# Altium project DONUts.PrjPCB
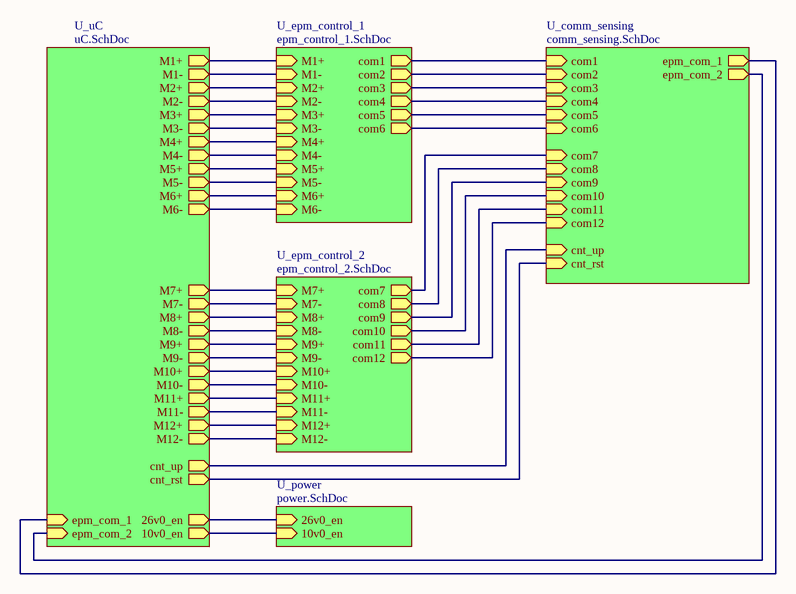
[diagram p0: DONUt_toplevel.SchDoc]
6 sheets, 266 parts. Net scope: hierarchical (ports join the sheet entries above them; power ports are global).
Board file: DONUt_v0.0.PcbDoc
Sheets:
  DONUt_toplevel.SchDoc
    U_power = power.SchDoc
    U_comm_sensing = comm_sensing.SchDoc
    U_uC = uC.SchDoc
    U_epm_control_1 = epm_control_1.SchDoc
    U_epm_control_2 = epm_control_2.SchDoc

## Sheet DONUt_toplevel.SchDoc
size A

### Sub-sheets
U_comm_sensing = comm_sensing.SchDoc: com1 (in), com2 (in), com3 (in), com4 (in), com5 (in), com6 (in), com7 (in), com8 (in), com9 (in), com10 (in), com11 (in), com12 (in), cnt_rst (in), cnt_up (in), epm_com_1 (out), epm_com_2 (out)
U_epm_control_1 = epm_control_1.SchDoc: M1+ (in), M1- (in), M2+ (in), M2- (in), com1 (out), com2 (out), com3 (out), com4 (out), com5 (out), com6 (out), M3+ (in), M3- (in), M4+ (in), M4- (in), M5+ (in), M5- (in), M6+ (in), M6- (in)
U_epm_control_2 = epm_control_2.SchDoc: com7 (out), com8 (out), com9 (out), com10 (out), com11 (out), com12 (out), M7+ (in), M7- (in), M8+ (in), M8- (in), M9+ (in), M9- (in), M10+ (in), M10- (in), M11+ (in), M11- (in), M12+ (in), M12- (in)
U_power = power.SchDoc: 26v0_en (in), 10v0_en (in)
U_uC = uC.SchDoc: M4- (out), M4+ (out), M3- (out), M3+ (out), M8- (out), M9+ (out), M9- (out), M10+ (out), M6- (out), M7+ (out), M7- (out), M8+ (out), M2- (out), M2+ (out), M1- (out), M1+ (out), M5- (out), M6+ (out), M5+ (out), M10- (out), M11+ (out), M11- (out), M12+ (out), M12- (out), 10v0_en (out), 26v0_en (out), cnt_up (out), cnt_rst (out), epm_com_2 (in), epm_com_1 (in)

### Nets
M1+: sheet U_uC/M1+, sheet U_epm_control_1/M1+
M1-: sheet U_uC/M1-, sheet U_epm_control_1/M1-
M2+: sheet U_uC/M2+, sheet U_epm_control_1/M2+
M2-: sheet U_uC/M2-, sheet U_epm_control_1/M2-
M3+: sheet U_uC/M3+, sheet U_epm_control_1/M3+
M3-: sheet U_uC/M3-, sheet U_epm_control_1/M3-
M4+: sheet U_uC/M4+, sheet U_epm_control_1/M4+
M4-: sheet U_uC/M4-, sheet U_epm_control_1/M4-
M5+: sheet U_uC/M5+, sheet U_epm_control_1/M5+
M5-: sheet U_uC/M5-, sheet U_epm_control_1/M5-
M6+: sheet U_uC/M6+, sheet U_epm_control_1/M6+
M6-: sheet U_uC/M6-, sheet U_epm_control_1/M6-
M7+: sheet U_uC/M7+, sheet U_epm_control_2/M7+
M7-: sheet U_uC/M7-, sheet U_epm_control_2/M7-
M8+: sheet U_uC/M8+, sheet U_epm_control_2/M8+
M8-: sheet U_uC/M8-, sheet U_epm_control_2/M8-
M9+: sheet U_uC/M9+, sheet U_epm_control_2/M9+
M9-: sheet U_uC/M9-, sheet U_epm_control_2/M9-
M10+: sheet U_uC/M10+, sheet U_epm_control_2/M10+
M10-: sheet U_uC/M10-, sheet U_epm_control_2/M10-
M11+: sheet U_uC/M11+, sheet U_epm_control_2/M11+
M11-: sheet U_uC/M11-, sheet U_epm_control_2/M11-
M12+: sheet U_uC/M12+, sheet U_epm_control_2/M12+
M12-: sheet U_uC/M12-, sheet U_epm_control_2/M12-
NetR173_1: sheet U_comm_sensing/com1, sheet U_epm_control_1/com1
NetR174_1: sheet U_comm_sensing/com2, sheet U_epm_control_1/com2
NetR175_1: sheet U_comm_sensing/com3, sheet U_epm_control_1/com3
NetR176_1: sheet U_comm_sensing/com4, sheet U_epm_control_1/com4
NetR177_1: sheet U_comm_sensing/com5, sheet U_epm_control_1/com5
NetR178_1: sheet U_comm_sensing/com6, sheet U_epm_control_1/com6
NetR179_1: sheet U_comm_sensing/com7, sheet U_epm_control_2/com7
NetR180_1: sheet U_comm_sensing/com8, sheet U_epm_control_2/com8
NetR181_1: sheet U_comm_sensing/com9, sheet U_epm_control_2/com9
NetR182_1: sheet U_comm_sensing/com10, sheet U_epm_control_2/com10
NetR183_1: sheet U_comm_sensing/com11, sheet U_epm_control_2/com11
NetR184_1: sheet U_comm_sensing/com12, sheet U_epm_control_2/com12
NetU1_25: sheet U_power/26v0_en, sheet U_uC/26v0_en
NetU1_26: sheet U_power/10v0_en, sheet U_uC/10v0_en
NetU2_19: sheet U_comm_sensing/epm_com_2, sheet U_uC/epm_com_2
NetU2_22: sheet U_comm_sensing/epm_com_1, sheet U_uC/epm_com_1
NetU2_23: sheet U_comm_sensing/cnt_rst, sheet U_uC/cnt_rst
NetU2_24: sheet U_comm_sensing/cnt_up, sheet U_uC/cnt_up

## Sheet power.SchDoc
size A
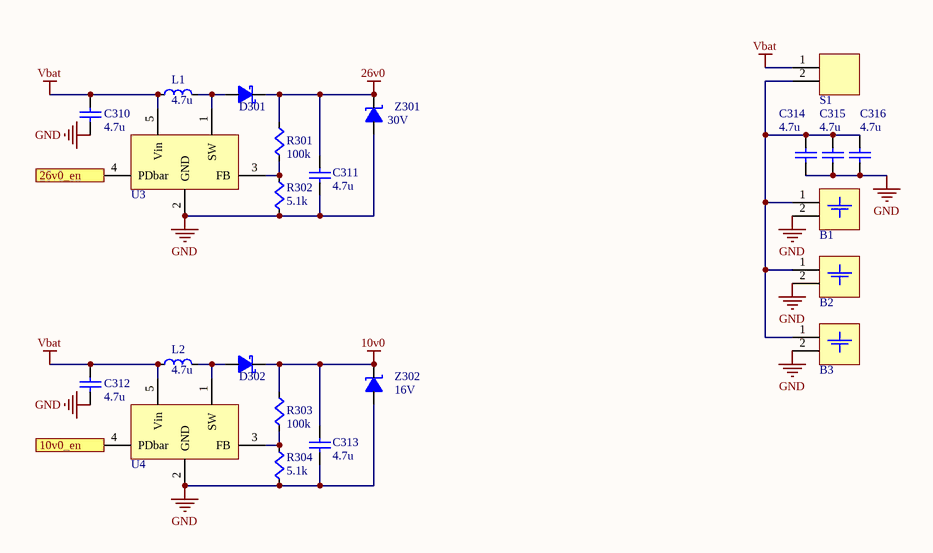
[diagram p1: power.SchDoc]

### Parts
B1  Batt  [batt_pads]  (value not drawn)
B2  Batt  [batt_pads]  (value not drawn)
B3  Batt  [batt_pads]  (value not drawn)
C310  value 4.7u  [SMD0603_cap]  (hidden comment: Cap)
C311  value 4.7u  [SMD0603_cap]  (hidden comment: Cap)
C312  value 4.7u  [SMD0603_cap]  (hidden comment: Cap)
C313  value 4.7u  [SMD0603_cap]  (hidden comment: Cap)
C314  value 4.7u  [SMD0603_cap]  (hidden comment: Cap)
C315  value 4.7u  [SMD0603_cap]  (hidden comment: Cap)
C316  value 4.7u  [SMD0603_cap]  (hidden comment: Cap)
D301  Shottky  [sod-323f]  (value not drawn)
D302  Shottky  [sod-323f]  (value not drawn)
L1  value 4.7u  [smd_0806]  (hidden comment: Inductor)
L2  value 4.7u  [smd_0806]  (hidden comment: Inductor)
R301  value 100k  [SMD0603]  (hidden comment: Res)
R302  value 5.1k  [SMD0603]  (hidden comment: Res)
R303  value 100k  [SMD0603]  (hidden comment: Res)
R304  value 5.1k  [SMD0603]  (hidden comment: Res)
S1  Header_smd-2x1  [header_smd-2x1]  (value not drawn)
U3  AP3012  [SOT23-5Lead]  (value not drawn)
U4  AP3012  [SOT23-5Lead]  (value not drawn)
Z301  value 30V  [SOD-323F]  (hidden comment: Zener)
Z302  value 16V  [SOD-323F]  (hidden comment: Zener)

### Ports
10v0_en (in), 26v0_en (in)

### Nets
10v0: C313.2 D302.K R303.2 Z302.K
26v0: C311.2 D301.K R301.2 Z301.K
GND: B1.2 B2.2 B3.2 C310.1 C311.1 C312.1 C313.1 C314.1 C315.1 C316.1 R302.1 R304.1 U3.2(GND) U4.2(GND) Z301.A Z302.A
Vbat: C310.2 C312.2 L1.1(Source) L2.1(Source) S1.1 U3.5(Vin) U4.5(Vin)
NetB1_1: B1.1 B2.1 B3.1 C314.2 C315.2 C316.2 S1.2
NetD301_A: D301.A L1.2(Source) U3.1(SW)
NetD302_A: D302.A L2.2(Source) U4.1(SW)
NetR301_1: R301.1 R302.2 U3.3(FB)
NetR303_1: R303.1 R304.2 U4.3(FB)
NetU1_25: U3.4(PDbar) ; port 26v0_en
NetU1_26: U4.4(PDbar) ; port 10v0_en

### Library data of the parts
C310-C316 = Capacitor Ceramic: Ceramic Chip Capacitor
L1 L2 = Inductor: Code_IEC: 1005; Published: 8-Jun-2000; LatestRevisionDate: 29-May-2009; LatestRevisionNote: IPC-7351 Footprint Added.; PackageReference: 0402-A; Publisher: Altium Limited; PackageDescription: Chip Inductor; Code_JEITA: 0402
R301-R304 = Resistor

## Sheet comm_sensing.SchDoc
size A
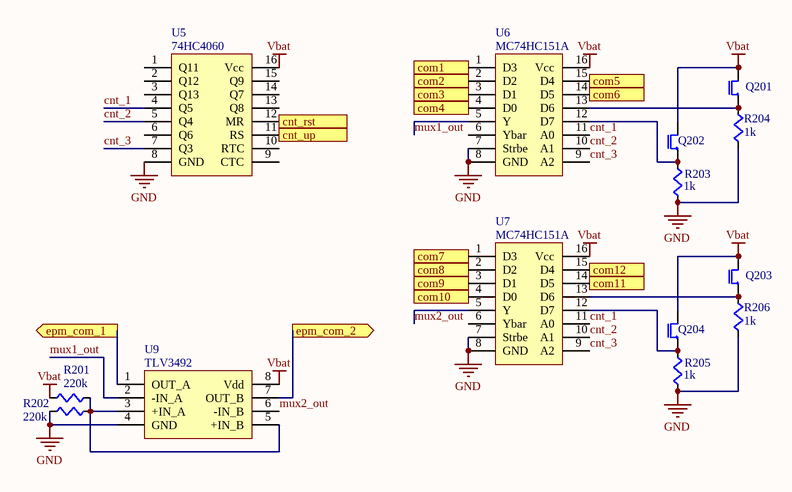
[diagram p2: comm_sensing.SchDoc]

### Parts
Q201  PHOTOTRANS  [smd_phototrans]  (value not drawn)
Q202  PHOTOTRANS  [smd_phototrans]  (value not drawn)
Q203  PHOTOTRANS  [smd_phototrans]  (value not drawn)
Q204  PHOTOTRANS  [smd_phototrans]  (value not drawn)
R201  value 220k  [SMD0603]  (hidden comment: Res)
R202  value 220k  [SMD0603]  (hidden comment: Res)
R203  value 1k  [SMD0603]  (hidden comment: Res)
R204  value 1k  [SMD0603]  (hidden comment: Res)
R205  value 1k  [SMD0603]  (hidden comment: Res)
R206  value 1k  [SMD0603]  (hidden comment: Res)
U5  74HC4060  [dhvqfn-16]
U6  MC74HC151A  [soic-16]
U7  MC74HC151A  [soic-16]
U9  TLV3492  [sot23-8]

### Ports
cnt_rst (in), cnt_up (in), com1 (in), com2 (in), com3 (in), com4 (in), com5 (in), com6 (in), com7 (in), com8 (in), com9 (in), com10 (in), com11 (in), com12 (in), epm_com_1 (out), epm_com_2 (out)

### Nets
GND: R202.2 R203.2 R204.2 R205.2 R206.2 U5.8(GND) U6.7(Strbe) U6.8(GND) U7.7(Strbe) U7.8(GND) U9.4(GND)
Vbat: Q201.1(Collector) Q202.1(Collector) Q203.1(Collector) Q204.1(Collector) R201.2 U5.16(Vcc) U6.16(Vcc) U7.16(Vcc) U9.8(Vdd)
cnt_1: U5.4(Q5) U6.11(A0) U7.11(A0)
cnt_2: U5.5(Q4) U6.10(A1) U7.10(A1)
cnt_3: U5.7(Q3) U6.9(A2) U7.9(A2)
mux1_out: U6.5(Y) U9.2(-IN_A)
mux2_out: U7.5(Y) U9.6(-IN_B)
NetQ201_2: Q201.2(Emitter) R204.1 U6.13(D6)
NetQ202_2: Q202.2(Emitter) R203.1 U6.12(D7)
NetQ203_2: Q203.2(Emitter) R206.1 U7.13(D6)
NetQ204_2: Q204.2(Emitter) R205.1 U7.12(D7)
NetR173_1: U6.1(D3) ; port com1
NetR174_1: U6.2(D2) ; port com2
NetR175_1: U6.3(D1) ; port com3
NetR176_1: U6.4(D0) ; port com4
NetR177_1: U6.15(D4) ; port com5
NetR178_1: U6.14(D5) ; port com6
NetR179_1: U7.1(D3) ; port com7
NetR180_1: U7.2(D2) ; port com8
NetR181_1: U7.3(D1) ; port com9
NetR182_1: U7.4(D0) ; port com10
NetR183_1: U7.14(D5) ; port com11
NetR184_1: U7.15(D4) ; port com12
NetR201_1: R201.1 R202.1 U9.3(+IN_A) U9.5(+IN_B)
NetU2_19: U9.7(OUT_B) ; port epm_com_2
NetU2_22: U9.1(OUT_A) ; port epm_com_1
NetU2_23: U5.12(MR) ; port cnt_rst
NetU2_24: U5.11(RS) ; port cnt_up

Not connected (* = marked no-connect by the designer): U5 1(Q11) 2(Q12) 3(Q13) 6(Q6) 9(CTC) 10(RTC) 13(Q8) 14(Q7) 15(Q9); U6 6(Ybar); U7 6(Ybar)

### Library data of the parts
R201-R206 = Resistor

## Sheet uC.SchDoc
size A
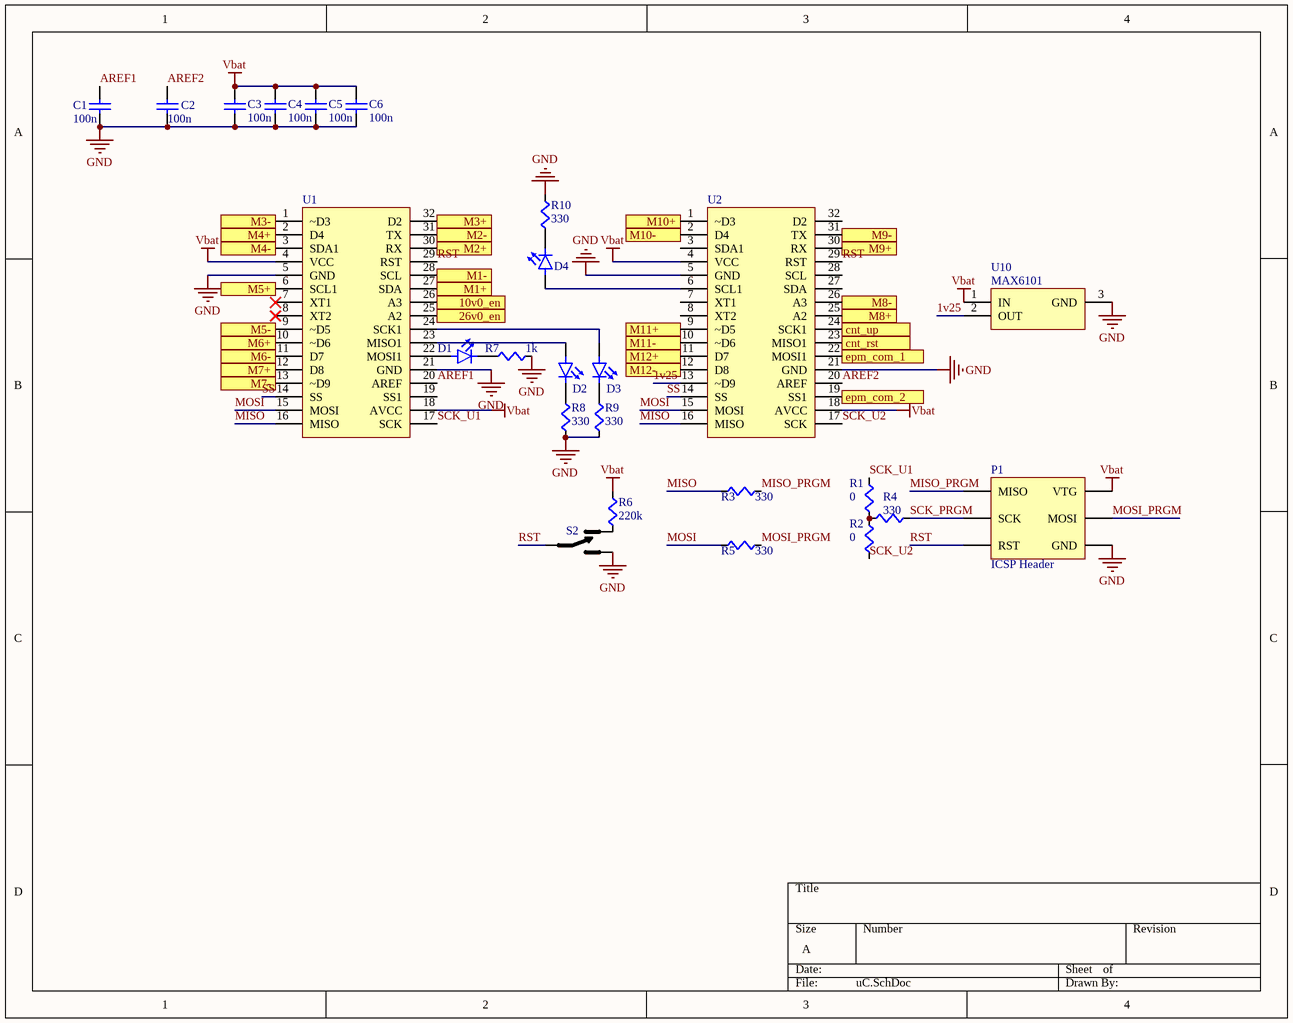
[diagram p3: uC.SchDoc]

### Parts
C1  value 100n  [SMD0603_cap]  (hidden comment: Cap)
C2  value 100n  [SMD0603_cap]  (hidden comment: Cap)
C3  value 100n  [SMD0603_cap]  (hidden comment: Cap)
C4  value 100n  [SMD0603_cap]  (hidden comment: Cap)
C5  value 100n  [SMD0603_cap]  (hidden comment: Cap)
C6  value 100n  [SMD0603_cap]  (hidden comment: Cap)
D1  LED  [SMD0603 POLARIZED]  (value not drawn)
D2  IR_LED  [smd_phototrans]  (value not drawn)
D3  IR_LED  [smd_phototrans]  (value not drawn)
D4  IR_LED  [smd_phototrans]  (value not drawn)
P1  ICSP Header  [icsp_pads]
R1  value 0  [SMD0603]  (hidden comment: Res)
R2  value 0  [SMD0603]  (hidden comment: Res)
R3  value 330  [SMD0603]  (hidden comment: Res)
R4  value 330  [SMD0603]  (hidden comment: Res)
R5  value 330  [SMD0603]  (hidden comment: Res)
R6  value 220k  [SMD0603]  (hidden comment: Res)
R7  value 1k  [SMD0603]  (hidden comment: Res)
R8  value 330  [SMD0603]  (hidden comment: Res)
R9  value 330  [SMD0603]  (hidden comment: Res)
R10  value 330  [SMD0603]  (hidden comment: Res)
S2  Switch_SPDT  [Switch_SPDT]  (value not drawn)
U1  ATMega328P_vqfn  [vqfn-32]  (value not drawn)
U2  ATMega328P_vqfn  [vqfn-32]  (value not drawn)
U10  MAX6101  [sot23]

### Ports
10v0_en (out), 26v0_en (out), cnt_rst (out), cnt_up (out), epm_com_1 (in), epm_com_2 (in), M1+ (out), M1- (out), M2+ (out), M2- (out), M3+ (out), M3- (out), M4+ (out), M4- (out), M5+ (out), M5- (out), M6+ (out), M6- (out), M7+ (out), M7- (out), M8+ (out), M8- (out), M9+ (out), M9- (out), M10+ (out), M10- (out), M11+ (out), M11- (out), M12+ (out), M12- (out)

### Nets
GND: C1.1 C2.1 C3.1 C4.1 C5.1 C6.1 P1.6(GND) R7.2 R8.1 R9.1 R10.1 S2.1 U1.5(GND) U1.21(GND) U2.5(GND) U2.21(GND) U10.3(GND)
Vbat: C3.2 C4.2 C5.2 C6.2 P1.2(VTG) R6.1 U1.4(VCC) U1.18(AVCC) U2.4(VCC) U2.18(AVCC) U10.1(IN)
1v25: U2.13(~D9) U10.2(OUT)
AREF1: C1.2 U1.20(AREF)
AREF2: C2.2 U2.20(AREF)
M1+: U1.27(SDA) ; port M1+
M1-: U1.28(SCL) ; port M1-
M2+: U1.30(RX) ; port M2+
M2-: U1.31(TX) ; port M2-
M3+: U1.32(D2) ; port M3+
M3-: U1.1(~D3) ; port M3-
M4+: U1.2(D4) ; port M4+
M4-: U1.3(SDA1) ; port M4-
M5+: U1.6(SCL1) ; port M5+
M5-: U1.9(~D5) ; port M5-
M6+: U1.10(~D6) ; port M6+
M6-: U1.11(D7) ; port M6-
M7+: U1.12(D8) ; port M7+
M7-: U1.13(~D9) ; port M7-
M8+: U2.25(A2) ; port M8+
M8-: U2.26(A3) ; port M8-
M9+: U2.30(RX) ; port M9+
M9-: U2.31(TX) ; port M9-
M10+: U2.1(~D3) ; port M10+
M10-: U2.2(D4) ; port M10-
M11+: U2.9(~D5) ; port M11+
M11-: U2.10(~D6) ; port M11-
M12+: U2.11(D7) ; port M12+
M12-: U2.12(D8) ; port M12-
MISO: R3.2 U1.16(MISO) U2.16(MISO)
MISO_PRGM: P1.1(MISO) R3.1
MOSI: R5.2 U1.15(MOSI) U2.15(MOSI)
MOSI_PRGM: P1.4(MOSI) R5.1
RST: P1.5(RST) S2.2 U1.29(RST) U2.29(RST)
SCK_PRGM: P1.3(SCK) R4.1
SCK_U1: R1.2 U1.17(SCK)
SCK_U2: R2.1 U2.17(SCK)
SS: U1.14(SS) U2.14(SS)
NetD1_1: D1.1(Anode_(+)) U1.22(MOSI1)
NetD1_2: D1.2(Cathode_(-)) R7.1
NetD2_1: D2.1(Anode_(+)) U1.23(MISO1)
NetD2_2: D2.2(Cathode_(-)) R8.2
NetD3_1: D3.1(Anode_(+)) U1.24(SCK1)
NetD3_2: D3.2(Cathode_(-)) R9.2
NetD4_1: D4.1(Anode_(+)) U2.6(SCL1)
NetD4_2: D4.2(Cathode_(-)) R10.2
NetR1_1: R1.1 R2.2 R4.2
NetR6_2: R6.2 S2.3
NetU1_25: U1.25(A2) ; port 26v0_en
NetU1_26: U1.26(A3) ; port 10v0_en
NetU2_19: U2.19(SS1) ; port epm_com_2
NetU2_22: U2.22(MOSI1) ; port epm_com_1
NetU2_23: U2.23(MISO1) ; port cnt_rst
NetU2_24: U2.24(SCK1) ; port cnt_up

Not connected (* = marked no-connect by the designer): U1 7(XT1)* 8(XT2)* 19(SS1); U2 3(SDA1) 7(XT1) 8(XT2) 27(SDA) 28(SCL) 32(D2)

### Library data of the parts
C1-C6 = Capacitor Ceramic: Ceramic Chip Capacitor
R1-R10 = Resistor

## Sheet epm_control_1.SchDoc
size A
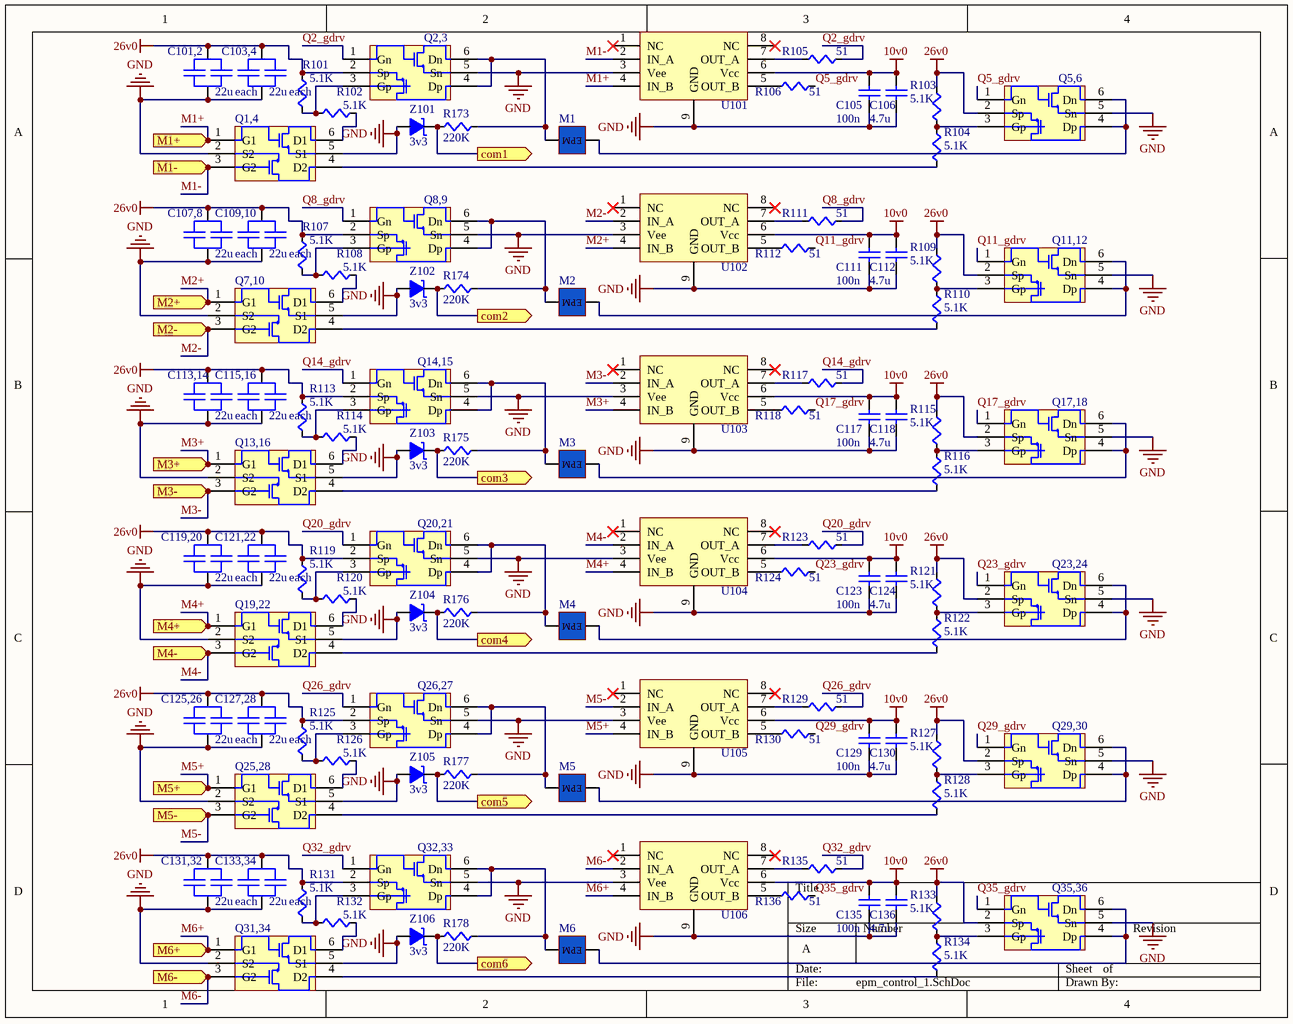
[diagram p4: epm_control_1.SchDoc]

### Parts
C101,2  value 22u  [dicap_smd_1206]  (hidden comment: Dicap)
C103,4  value 22u  [dicap_smd_1206]  (hidden comment: Dicap)
C105  value 100n  [SMD0603_cap]  (hidden comment: Cap)
C106  value 4.7u  [SMD0603_cap]  (hidden comment: Cap)
C107,8  value 22u  [dicap_smd_1206]  (hidden comment: Dicap)
C109,10  value 22u  [dicap_smd_1206]  (hidden comment: Dicap)
C111  value 100n  [SMD0603_cap]  (hidden comment: Cap)
C112  value 4.7u  [SMD0603_cap]  (hidden comment: Cap)
C113,14  value 22u  [dicap_smd_1206]  (hidden comment: Dicap)
C115,16  value 22u  [dicap_smd_1206]  (hidden comment: Dicap)
C117  value 100n  [SMD0603_cap]  (hidden comment: Cap)
C118  value 4.7u  [SMD0603_cap]  (hidden comment: Cap)
C119,20  value 22u  [dicap_smd_1206]  (hidden comment: Dicap)
C121,22  value 22u  [dicap_smd_1206]  (hidden comment: Dicap)
C123  value 100n  [SMD0603_cap]  (hidden comment: Cap)
C124  value 4.7u  [SMD0603_cap]  (hidden comment: Cap)
C125,26  value 22u  [dicap_smd_1206]  (hidden comment: Dicap)
C127,28  value 22u  [dicap_smd_1206]  (hidden comment: Dicap)
C129  value 100n  [SMD0603_cap]  (hidden comment: Cap)
C130  value 4.7u  [SMD0603_cap]  (hidden comment: Cap)
C131,32  value 22u  [dicap_smd_1206]  (hidden comment: Dicap)
C133,34  value 22u  [dicap_smd_1206]  (hidden comment: Dicap)
C135  value 100n  [SMD0603_cap]  (hidden comment: Cap)
C136  value 4.7u  [SMD0603_cap]  (hidden comment: Cap)
M1  EPM  [40awg_epm]  (value not drawn)
M2  EPM  [40awg_epm]  (value not drawn)
M3  EPM  [40awg_epm]  (value not drawn)
M4  EPM  [40awg_epm]  (value not drawn)
M5  EPM  [40awg_epm]  (value not drawn)
M6  EPM  [40awg_epm]  (value not drawn)
Q1,4  SI3292  [sot23-6l]  (value not drawn)
Q2,3  DMG6602  [sot23-6l]  (value not drawn)
Q5,6  DMG6602  [sot23-6l]  (value not drawn)
Q7,10  SI3292  [sot23-6l]  (value not drawn)
Q8,9  DMG6602  [sot23-6l]  (value not drawn)
Q11,12  DMG6602  [sot23-6l]  (value not drawn)
Q13,16  SI3292  [sot23-6l]  (value not drawn)
Q14,15  DMG6602  [sot23-6l]  (value not drawn)
Q17,18  DMG6602  [sot23-6l]  (value not drawn)
Q19,22  SI3292  [sot23-6l]  (value not drawn)
Q20,21  DMG6602  [sot23-6l]  (value not drawn)
Q23,24  DMG6602  [sot23-6l]  (value not drawn)
Q25,28  SI3292  [sot23-6l]  (value not drawn)
Q26,27  DMG6602  [sot23-6l]  (value not drawn)
Q29,30  DMG6602  [sot23-6l]  (value not drawn)
Q31,34  SI3292  [sot23-6l]  (value not drawn)
Q32,33  DMG6602  [sot23-6l]  (value not drawn)
Q35,36  DMG6602  [sot23-6l]  (value not drawn)
R101  value 5.1K  [SMD0603]  (hidden comment: Res)
R102  value 5.1K  [SMD0603]  (hidden comment: Res)
R103  value 5.1K  [SMD0603]  (hidden comment: Res)
R104  value 5.1K  [SMD0603]  (hidden comment: Res)
R105  value 51  [SMD0603]  (hidden comment: Res)
R106  value 51  [SMD0603]  (hidden comment: Res)
R107  value 5.1K  [SMD0603]  (hidden comment: Res)
R108  value 5.1K  [SMD0603]  (hidden comment: Res)
R109  value 5.1K  [SMD0603]  (hidden comment: Res)
R110  value 5.1K  [SMD0603]  (hidden comment: Res)
R111  value 51  [SMD0603]  (hidden comment: Res)
R112  value 51  [SMD0603]  (hidden comment: Res)
R113  value 5.1K  [SMD0603]  (hidden comment: Res)
R114  value 5.1K  [SMD0603]  (hidden comment: Res)
R115  value 5.1K  [SMD0603]  (hidden comment: Res)
R116  value 5.1K  [SMD0603]  (hidden comment: Res)
R117  value 51  [SMD0603]  (hidden comment: Res)
R118  value 51  [SMD0603]  (hidden comment: Res)
R119  value 5.1K  [SMD0603]  (hidden comment: Res)
R120  value 5.1K  [SMD0603]  (hidden comment: Res)
R121  value 5.1K  [SMD0603]  (hidden comment: Res)
R122  value 5.1K  [SMD0603]  (hidden comment: Res)
R123  value 51  [SMD0603]  (hidden comment: Res)
R124  value 51  [SMD0603]  (hidden comment: Res)
R125  value 5.1K  [SMD0603]  (hidden comment: Res)
R126  value 5.1K  [SMD0603]  (hidden comment: Res)
R127  value 5.1K  [SMD0603]  (hidden comment: Res)
R128  value 5.1K  [SMD0603]  (hidden comment: Res)
R129  value 51  [SMD0603]  (hidden comment: Res)
R130  value 51  [SMD0603]  (hidden comment: Res)
R131  value 5.1K  [SMD0603]  (hidden comment: Res)
R132  value 5.1K  [SMD0603]  (hidden comment: Res)
R133  value 5.1K  [SMD0603]  (hidden comment: Res)
R134  value 5.1K  [SMD0603]  (hidden comment: Res)
R135  value 51  [SMD0603]  (hidden comment: Res)
R136  value 51  [SMD0603]  (hidden comment: Res)
R173  value 220K  [SMD0603]  (hidden comment: Res)
R174  value 220K  [SMD0603]  (hidden comment: Res)
R175  value 220K  [SMD0603]  (hidden comment: Res)
R176  value 220K  [SMD0603]  (hidden comment: Res)
R177  value 220K  [SMD0603]  (hidden comment: Res)
R178  value 220K  [SMD0603]  (hidden comment: Res)
U101  LM5111-1  [tssop-8]  (value not drawn)
U102  LM5111-1  [tssop-8]  (value not drawn)
U103  LM5111-1  [tssop-8]  (value not drawn)
U104  LM5111-1  [tssop-8]  (value not drawn)
U105  LM5111-1  [tssop-8]  (value not drawn)
U106  LM5111-1  [tssop-8]  (value not drawn)
Z101  value 3v3  [SOD-323F]  (hidden comment: Zener)
Z102  value 3v3  [SOD-323F]  (hidden comment: Zener)
Z103  value 3v3  [SOD-323F]  (hidden comment: Zener)
Z104  value 3v3  [SOD-323F]  (hidden comment: Zener)
Z105  value 3v3  [SOD-323F]  (hidden comment: Zener)
Z106  value 3v3  [SOD-323F]  (hidden comment: Zener)

### Ports
com1 (out), com2 (out), com3 (out), com4 (out), com5 (out), com6 (out), M1+ (in), M1- (in), M2+ (in), M2- (in), M3+ (in), M3- (in), M4+ (in), M4- (in), M5+ (in), M5- (in), M6+ (in), M6- (in)

### Nets
10v0: C105.2 C106.2 C111.2 C112.2 C117.2 C118.2 C123.2 C124.2 C129.2 C130.2 C135.2 C136.2 U101.6(Vcc) U102.6(Vcc) U103.6(Vcc) U104.6(Vcc) U105.6(Vcc) U106.6(Vcc)
26v0: C101,2.2 C103,4.2 C107,8.2 C109,10.2 C113,14.2 C115,16.2 C119,20.2 C121,22.2 C125,26.2 C127,28.2 C131,32.2 C133,34.2 Q2,3.2(Sp) Q5,6.2(Sp) Q8,9.2(Sp) Q11,12.2(Sp) Q14,15.2(Sp) Q17,18.2(Sp) Q20,21.2(Sp) Q23,24.2(Sp) Q26,27.2(Sp) Q29,30.2(Sp) Q32,33.2(Sp) Q35,36.2(Sp) R101.2 R103.2 R107.2 R109.2 R113.2 R115.2 R119.2 R121.2 R125.2 R127.2 R131.2 R133.2
GND: C101,2.1 C103,4.1 C105.1 C106.1 C107,8.1 C109,10.1 C111.1 C112.1 C113,14.1 C115,16.1 C117.1 C118.1 C119,20.1 C121,22.1 C123.1 C124.1 C125,26.1 C127,28.1 C129.1 C130.1 C131,32.1 C133,34.1 C135.1 C136.1 Q1,4.2(S2) Q1,4.5(S1) Q2,3.5(Sn) Q5,6.5(Sn) Q7,10.2(S2) Q7,10.5(S1) Q8,9.5(Sn) Q11,12.5(Sn) Q13,16.2(S2) Q13,16.5(S1) Q14,15.5(Sn) Q17,18.5(Sn) Q19,22.2(S2) Q19,22.5(S1) Q20,21.5(Sn) Q23,24.5(Sn) Q25,28.2(S2) Q25,28.5(S1) Q26,27.5(Sn) Q29,30.5(Sn) Q31,34.2(S2) Q31,34.5(S1) Q32,33.5(Sn) Q35,36.5(Sn) U101.3(Vee) U101.9(GND) U102.3(Vee) U102.9(GND) U103.3(Vee) U103.9(GND) U104.3(Vee) U104.9(GND) U105.3(Vee) U105.9(GND) U106.3(Vee) U106.9(GND) Z101.A Z102.A Z103.A Z104.A Z105.A Z106.A
M1+: Q1,4.1(G1) U101.4(IN_B) ; port M1+
M1-: Q1,4.3(G2) U101.2(IN_A) ; port M1-
M2+: Q7,10.1(G1) U102.4(IN_B) ; port M2+
M2-: Q7,10.3(G2) U102.2(IN_A) ; port M2-
M3+: Q13,16.1(G1) U103.4(IN_B) ; port M3+
M3-: Q13,16.3(G2) U103.2(IN_A) ; port M3-
M4+: Q19,22.1(G1) U104.4(IN_B) ; port M4+
M4-: Q19,22.3(G2) U104.2(IN_A) ; port M4-
M5+: Q25,28.1(G1) U105.4(IN_B) ; port M5+
M5-: Q25,28.3(G2) U105.2(IN_A) ; port M5-
M6+: Q31,34.1(G1) U106.4(IN_B) ; port M6+
M6-: Q31,34.3(G2) U106.2(IN_A) ; port M6-
Q2_gdrv: Q2,3.1(Gn) R105.1
Q5_gdrv: Q5,6.1(Gn) R106.1
Q8_gdrv: Q8,9.1(Gn) R111.1
Q11_gdrv: Q11,12.1(Gn) R112.1
Q14_gdrv: Q14,15.1(Gn) R117.1
Q17_gdrv: Q17,18.1(Gn) R118.1
Q20_gdrv: Q20,21.1(Gn) R123.1
Q23_gdrv: Q23,24.1(Gn) R124.1
Q26_gdrv: Q26,27.1(Gn) R129.1
Q29_gdrv: Q29,30.1(Gn) R130.1
Q32_gdrv: Q32,33.1(Gn) R135.1
Q35_gdrv: Q35,36.1(Gn) R136.1
NetM1_1: M1.1 Q5,6.4(Dp) Q5,6.6(Dn)
NetM1_2: M1.2 Q2,3.4(Dp) Q2,3.6(Dn) R173.2
NetM2_1: M2.1 Q11,12.4(Dp) Q11,12.6(Dn)
NetM2_2: M2.2 Q8,9.4(Dp) Q8,9.6(Dn) R174.2
NetM3_1: M3.1 Q17,18.4(Dp) Q17,18.6(Dn)
NetM3_2: M3.2 Q14,15.4(Dp) Q14,15.6(Dn) R175.2
NetM4_1: M4.1 Q23,24.4(Dp) Q23,24.6(Dn)
NetM4_2: M4.2 Q20,21.4(Dp) Q20,21.6(Dn) R176.2
NetM5_1: M5.1 Q29,30.4(Dp) Q29,30.6(Dn)
NetM5_2: M5.2 Q26,27.4(Dp) Q26,27.6(Dn) R177.2
NetM6_1: M6.1 Q35,36.4(Dp) Q35,36.6(Dn)
NetM6_2: M6.2 Q32,33.4(Dp) Q32,33.6(Dn) R178.2
NetQ1,4_4: Q1,4.4(D2) R104.1
NetQ1,4_6: Q1,4.6(D1) R102.1
NetQ2,3_3: Q2,3.3(Gp) R101.1 R102.2
NetQ5,6_3: Q5,6.3(Gp) R103.1 R104.2
NetQ7,10_4: Q7,10.4(D2) R110.1
NetQ7,10_6: Q7,10.6(D1) R108.1
NetQ8,9_3: Q8,9.3(Gp) R107.1 R108.2
NetQ11,12_3: Q11,12.3(Gp) R109.1 R110.2
NetQ13,16_4: Q13,16.4(D2) R116.1
NetQ13,16_6: Q13,16.6(D1) R114.1
NetQ14,15_3: Q14,15.3(Gp) R113.1 R114.2
NetQ17,18_3: Q17,18.3(Gp) R115.1 R116.2
NetQ19,22_4: Q19,22.4(D2) R122.1
NetQ19,22_6: Q19,22.6(D1) R120.1
NetQ20,21_3: Q20,21.3(Gp) R119.1 R120.2
NetQ23,24_3: Q23,24.3(Gp) R121.1 R122.2
NetQ25,28_4: Q25,28.4(D2) R128.1
NetQ25,28_6: Q25,28.6(D1) R126.1
NetQ26,27_3: Q26,27.3(Gp) R125.1 R126.2
NetQ29,30_3: Q29,30.3(Gp) R127.1 R128.2
NetQ31,34_4: Q31,34.4(D2) R134.1
NetQ31,34_6: Q31,34.6(D1) R132.1
NetQ32,33_3: Q32,33.3(Gp) R131.1 R132.2
NetQ35,36_3: Q35,36.3(Gp) R133.1 R134.2
NetR105_2: R105.2 U101.7(OUT_A)
NetR106_2: R106.2 U101.5(OUT_B)
NetR111_2: R111.2 U102.7(OUT_A)
NetR112_2: R112.2 U102.5(OUT_B)
NetR117_2: R117.2 U103.7(OUT_A)
NetR118_2: R118.2 U103.5(OUT_B)
NetR123_2: R123.2 U104.7(OUT_A)
NetR124_2: R124.2 U104.5(OUT_B)
NetR129_2: R129.2 U105.7(OUT_A)
NetR130_2: R130.2 U105.5(OUT_B)
NetR135_2: R135.2 U106.7(OUT_A)
NetR136_2: R136.2 U106.5(OUT_B)
NetR173_1: R173.1 Z101.K ; port com1
NetR174_1: R174.1 Z102.K ; port com2
NetR175_1: R175.1 Z103.K ; port com3
NetR176_1: R176.1 Z104.K ; port com4
NetR177_1: R177.1 Z105.K ; port com5
NetR178_1: R178.1 Z106.K ; port com6

Not connected (* = marked no-connect by the designer): U101 1(NC)* 8(NC)*; U102 1(NC)* 8(NC)*; U103 1(NC)* 8(NC)*; U104 1(NC)* 8(NC)*; U105 1(NC)* 8(NC)*; U106 1(NC)* 8(NC)*

### Notes on the sheet
- (in symbol Dicap) each

### Library data of the parts
C105 C106 C111 C112 C117 C118 C123 C124 C129 C130 C135 C136 = Capacitor Ceramic: Ceramic Chip Capacitor
R101-R136 R173-R178 = Resistor

## Sheet epm_control_2.SchDoc
size A
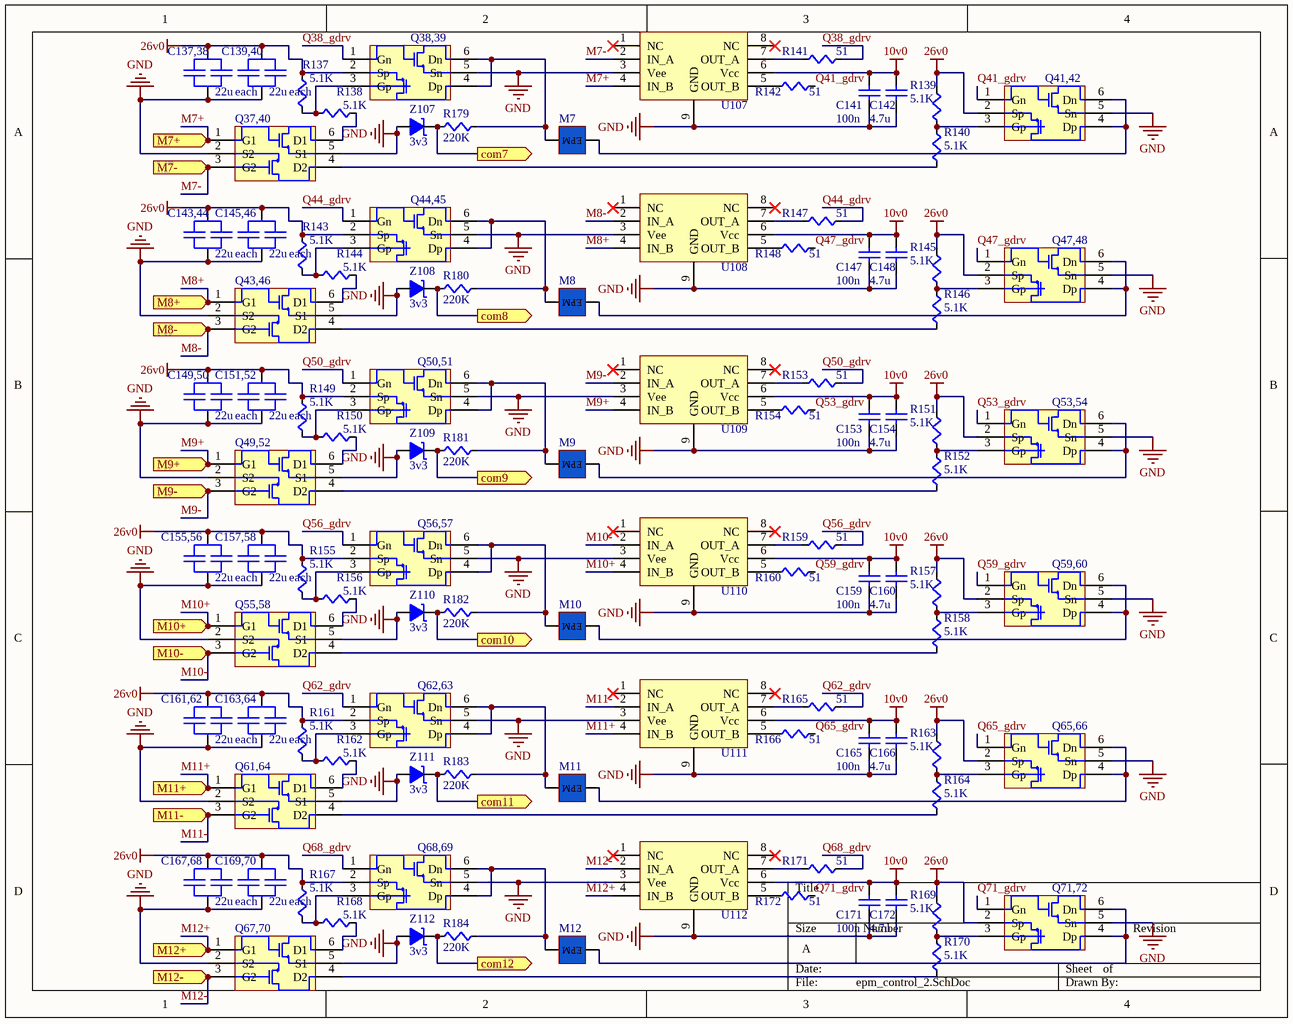
[diagram p5: epm_control_2.SchDoc]

### Parts
C137,38  value 22u  [dicap_smd_1206]  (hidden comment: Dicap)
C139,40  value 22u  [dicap_smd_1206]  (hidden comment: Dicap)
C141  value 100n  [SMD0603_cap]  (hidden comment: Cap)
C142  value 4.7u  [SMD0603_cap]  (hidden comment: Cap)
C143,44  value 22u  [dicap_smd_1206]  (hidden comment: Dicap)
C145,46  value 22u  [dicap_smd_1206]  (hidden comment: Dicap)
C147  value 100n  [SMD0603_cap]  (hidden comment: Cap)
C148  value 4.7u  [SMD0603_cap]  (hidden comment: Cap)
C149,50  value 22u  [dicap_smd_1206]  (hidden comment: Dicap)
C151,52  value 22u  [dicap_smd_1206]  (hidden comment: Dicap)
C153  value 100n  [SMD0603_cap]  (hidden comment: Cap)
C154  value 4.7u  [SMD0603_cap]  (hidden comment: Cap)
C155,56  value 22u  [dicap_smd_1206]  (hidden comment: Dicap)
C157,58  value 22u  [dicap_smd_1206]  (hidden comment: Dicap)
C159  value 100n  [SMD0603_cap]  (hidden comment: Cap)
C160  value 4.7u  [SMD0603_cap]  (hidden comment: Cap)
C161,62  value 22u  [dicap_smd_1206]  (hidden comment: Dicap)
C163,64  value 22u  [dicap_smd_1206]  (hidden comment: Dicap)
C165  value 100n  [SMD0603_cap]  (hidden comment: Cap)
C166  value 4.7u  [SMD0603_cap]  (hidden comment: Cap)
C167,68  value 22u  [dicap_smd_1206]  (hidden comment: Dicap)
C169,70  value 22u  [dicap_smd_1206]  (hidden comment: Dicap)
C171  value 100n  [SMD0603_cap]  (hidden comment: Cap)
C172  value 4.7u  [SMD0603_cap]  (hidden comment: Cap)
M7  EPM  [40awg_epm]  (value not drawn)
M8  EPM  [40awg_epm]  (value not drawn)
M9  EPM  [40awg_epm]  (value not drawn)
M10  EPM  [40awg_epm]  (value not drawn)
M11  EPM  [40awg_epm]  (value not drawn)
M12  EPM  [40awg_epm]  (value not drawn)
Q37,40  SI3292  [sot23-6l]  (value not drawn)
Q38,39  DMG6602  [sot23-6l]  (value not drawn)
Q41,42  DMG6602  [sot23-6l]  (value not drawn)
Q43,46  SI3292  [sot23-6l]  (value not drawn)
Q44,45  DMG6602  [sot23-6l]  (value not drawn)
Q47,48  DMG6602  [sot23-6l]  (value not drawn)
Q49,52  SI3292  [sot23-6l]  (value not drawn)
Q50,51  DMG6602  [sot23-6l]  (value not drawn)
Q53,54  DMG6602  [sot23-6l]  (value not drawn)
Q55,58  SI3292  [sot23-6l]  (value not drawn)
Q56,57  DMG6602  [sot23-6l]  (value not drawn)
Q59,60  DMG6602  [sot23-6l]  (value not drawn)
Q61,64  SI3292  [sot23-6l]  (value not drawn)
Q62,63  DMG6602  [sot23-6l]  (value not drawn)
Q65,66  DMG6602  [sot23-6l]  (value not drawn)
Q67,70  SI3292  [sot23-6l]  (value not drawn)
Q68,69  DMG6602  [sot23-6l]  (value not drawn)
Q71,72  DMG6602  [sot23-6l]  (value not drawn)
R137  value 5.1K  [SMD0603]  (hidden comment: Res)
R138  value 5.1K  [SMD0603]  (hidden comment: Res)
R139  value 5.1K  [SMD0603]  (hidden comment: Res)
R140  value 5.1K  [SMD0603]  (hidden comment: Res)
R141  value 51  [SMD0603]  (hidden comment: Res)
R142  value 51  [SMD0603]  (hidden comment: Res)
R143  value 5.1K  [SMD0603]  (hidden comment: Res)
R144  value 5.1K  [SMD0603]  (hidden comment: Res)
R145  value 5.1K  [SMD0603]  (hidden comment: Res)
R146  value 5.1K  [SMD0603]  (hidden comment: Res)
R147  value 51  [SMD0603]  (hidden comment: Res)
R148  value 51  [SMD0603]  (hidden comment: Res)
R149  value 5.1K  [SMD0603]  (hidden comment: Res)
R150  value 5.1K  [SMD0603]  (hidden comment: Res)
R151  value 5.1K  [SMD0603]  (hidden comment: Res)
R152  value 5.1K  [SMD0603]  (hidden comment: Res)
R153  value 51  [SMD0603]  (hidden comment: Res)
R154  value 51  [SMD0603]  (hidden comment: Res)
R155  value 5.1K  [SMD0603]  (hidden comment: Res)
R156  value 5.1K  [SMD0603]  (hidden comment: Res)
R157  value 5.1K  [SMD0603]  (hidden comment: Res)
R158  value 5.1K  [SMD0603]  (hidden comment: Res)
R159  value 51  [SMD0603]  (hidden comment: Res)
R160  value 51  [SMD0603]  (hidden comment: Res)
R161  value 5.1K  [SMD0603]  (hidden comment: Res)
R162  value 5.1K  [SMD0603]  (hidden comment: Res)
R163  value 5.1K  [SMD0603]  (hidden comment: Res)
R164  value 5.1K  [SMD0603]  (hidden comment: Res)
R165  value 51  [SMD0603]  (hidden comment: Res)
R166  value 51  [SMD0603]  (hidden comment: Res)
R167  value 5.1K  [SMD0603]  (hidden comment: Res)
R168  value 5.1K  [SMD0603]  (hidden comment: Res)
R169  value 5.1K  [SMD0603]  (hidden comment: Res)
R170  value 5.1K  [SMD0603]  (hidden comment: Res)
R171  value 51  [SMD0603]  (hidden comment: Res)
R172  value 51  [SMD0603]  (hidden comment: Res)
R179  value 220K  [SMD0603]  (hidden comment: Res)
R180  value 220K  [SMD0603]  (hidden comment: Res)
R181  value 220K  [SMD0603]  (hidden comment: Res)
R182  value 220K  [SMD0603]  (hidden comment: Res)
R183  value 220K  [SMD0603]  (hidden comment: Res)
R184  value 220K  [SMD0603]  (hidden comment: Res)
U107  LM5111-1  [tssop-8]  (value not drawn)
U108  LM5111-1  [tssop-8]  (value not drawn)
U109  LM5111-1  [tssop-8]  (value not drawn)
U110  LM5111-1  [tssop-8]  (value not drawn)
U111  LM5111-1  [tssop-8]  (value not drawn)
U112  LM5111-1  [tssop-8]  (value not drawn)
Z107  value 3v3  [SOD-323F]  (hidden comment: Zener)
Z108  value 3v3  [SOD-323F]  (hidden comment: Zener)
Z109  value 3v3  [SOD-323F]  (hidden comment: Zener)
Z110  value 3v3  [SOD-323F]  (hidden comment: Zener)
Z111  value 3v3  [SOD-323F]  (hidden comment: Zener)
Z112  value 3v3  [SOD-323F]  (hidden comment: Zener)

### Ports
com7 (out), com8 (out), com9 (out), com10 (out), com11 (out), com12 (out), M7+ (in), M7- (in), M8+ (in), M8- (in), M9+ (in), M9- (in), M10+ (in), M10- (in), M11+ (in), M11- (in), M12+ (in), M12- (in)

### Nets
10v0: C141.2 C142.2 C147.2 C148.2 C153.2 C154.2 C159.2 C160.2 C165.2 C166.2 C171.2 C172.2 U107.6(Vcc) U108.6(Vcc) U109.6(Vcc) U110.6(Vcc) U111.6(Vcc) U112.6(Vcc)
26v0: C137,38.2 C139,40.2 C143,44.2 C145,46.2 C149,50.2 C151,52.2 C155,56.2 C157,58.2 C161,62.2 C163,64.2 C167,68.2 C169,70.2 Q38,39.2(Sp) Q41,42.2(Sp) Q44,45.2(Sp) Q47,48.2(Sp) Q50,51.2(Sp) Q53,54.2(Sp) Q56,57.2(Sp) Q59,60.2(Sp) Q62,63.2(Sp) Q65,66.2(Sp) Q68,69.2(Sp) Q71,72.2(Sp) R137.2 R139.2 R143.2 R145.2 R149.2 R151.2 R155.2 R157.2 R161.2 R163.2 R167.2 R169.2
GND: C137,38.1 C139,40.1 C141.1 C142.1 C143,44.1 C145,46.1 C147.1 C148.1 C149,50.1 C151,52.1 C153.1 C154.1 C155,56.1 C157,58.1 C159.1 C160.1 C161,62.1 C163,64.1 C165.1 C166.1 C167,68.1 C169,70.1 C171.1 C172.1 Q37,40.2(S2) Q37,40.5(S1) Q38,39.5(Sn) Q41,42.5(Sn) Q43,46.2(S2) Q43,46.5(S1) Q44,45.5(Sn) Q47,48.5(Sn) Q49,52.2(S2) Q49,52.5(S1) Q50,51.5(Sn) Q53,54.5(Sn) Q55,58.2(S2) Q55,58.5(S1) Q56,57.5(Sn) Q59,60.5(Sn) Q61,64.2(S2) Q61,64.5(S1) Q62,63.5(Sn) Q65,66.5(Sn) Q67,70.2(S2) Q67,70.5(S1) Q68,69.5(Sn) Q71,72.5(Sn) U107.3(Vee) U107.9(GND) U108.3(Vee) U108.9(GND) U109.3(Vee) U109.9(GND) U110.3(Vee) U110.9(GND) U111.3(Vee) U111.9(GND) U112.3(Vee) U112.9(GND) Z107.A Z108.A Z109.A Z110.A Z111.A Z112.A
M7+: Q37,40.1(G1) U107.4(IN_B) ; port M7+
M7-: Q37,40.3(G2) U107.2(IN_A) ; port M7-
M8+: Q43,46.1(G1) U108.4(IN_B) ; port M8+
M8-: Q43,46.3(G2) U108.2(IN_A) ; port M8-
M9+: Q49,52.1(G1) U109.4(IN_B) ; port M9+
M9-: Q49,52.3(G2) U109.2(IN_A) ; port M9-
M10+: Q55,58.1(G1) U110.4(IN_B) ; port M10+
M10-: Q55,58.3(G2) U110.2(IN_A) ; port M10-
M11+: Q61,64.1(G1) U111.4(IN_B) ; port M11+
M11-: Q61,64.3(G2) U111.2(IN_A) ; port M11-
M12+: Q67,70.1(G1) U112.4(IN_B) ; port M12+
M12-: Q67,70.3(G2) U112.2(IN_A) ; port M12-
Q38_gdrv: Q38,39.1(Gn) R141.1
Q41_gdrv: Q41,42.1(Gn) R142.1
Q44_gdrv: Q44,45.1(Gn) R147.1
Q47_gdrv: Q47,48.1(Gn) R148.1
Q50_gdrv: Q50,51.1(Gn) R153.1
Q53_gdrv: Q53,54.1(Gn) R154.1
Q56_gdrv: Q56,57.1(Gn) R159.1
Q59_gdrv: Q59,60.1(Gn) R160.1
Q62_gdrv: Q62,63.1(Gn) R165.1
Q65_gdrv: Q65,66.1(Gn) R166.1
Q68_gdrv: Q68,69.1(Gn) R171.1
Q71_gdrv: Q71,72.1(Gn) R172.1
NetM7_1: M7.1 Q41,42.4(Dp) Q41,42.6(Dn)
NetM7_2: M7.2 Q38,39.4(Dp) Q38,39.6(Dn) R179.2
NetM8_1: M8.1 Q47,48.4(Dp) Q47,48.6(Dn)
NetM8_2: M8.2 Q44,45.4(Dp) Q44,45.6(Dn) R180.2
NetM9_1: M9.1 Q53,54.4(Dp) Q53,54.6(Dn)
NetM9_2: M9.2 Q50,51.4(Dp) Q50,51.6(Dn) R181.2
NetM10_1: M10.1 Q59,60.4(Dp) Q59,60.6(Dn)
NetM10_2: M10.2 Q56,57.4(Dp) Q56,57.6(Dn) R182.2
NetM11_1: M11.1 Q65,66.4(Dp) Q65,66.6(Dn)
NetM11_2: M11.2 Q62,63.4(Dp) Q62,63.6(Dn) R183.2
NetM12_1: M12.1 Q71,72.4(Dp) Q71,72.6(Dn)
NetM12_2: M12.2 Q68,69.4(Dp) Q68,69.6(Dn) R184.2
NetQ37,40_4: Q37,40.4(D2) R140.1
NetQ37,40_6: Q37,40.6(D1) R138.1
NetQ38,39_3: Q38,39.3(Gp) R137.1 R138.2
NetQ41,42_3: Q41,42.3(Gp) R139.1 R140.2
NetQ43,46_4: Q43,46.4(D2) R146.1
NetQ43,46_6: Q43,46.6(D1) R144.1
NetQ44,45_3: Q44,45.3(Gp) R143.1 R144.2
NetQ47,48_3: Q47,48.3(Gp) R145.1 R146.2
NetQ49,52_4: Q49,52.4(D2) R152.1
NetQ49,52_6: Q49,52.6(D1) R150.1
NetQ50,51_3: Q50,51.3(Gp) R149.1 R150.2
NetQ53,54_3: Q53,54.3(Gp) R151.1 R152.2
NetQ55,58_4: Q55,58.4(D2) R158.1
NetQ55,58_6: Q55,58.6(D1) R156.1
NetQ56,57_3: Q56,57.3(Gp) R155.1 R156.2
NetQ59,60_3: Q59,60.3(Gp) R157.1 R158.2
NetQ61,64_4: Q61,64.4(D2) R164.1
NetQ61,64_6: Q61,64.6(D1) R162.1
NetQ62,63_3: Q62,63.3(Gp) R161.1 R162.2
NetQ65,66_3: Q65,66.3(Gp) R163.1 R164.2
NetQ67,70_4: Q67,70.4(D2) R170.1
NetQ67,70_6: Q67,70.6(D1) R168.1
NetQ68,69_3: Q68,69.3(Gp) R167.1 R168.2
NetQ71,72_3: Q71,72.3(Gp) R169.1 R170.2
NetR141_2: R141.2 U107.7(OUT_A)
NetR142_2: R142.2 U107.5(OUT_B)
NetR147_2: R147.2 U108.7(OUT_A)
NetR148_2: R148.2 U108.5(OUT_B)
NetR153_2: R153.2 U109.7(OUT_A)
NetR154_2: R154.2 U109.5(OUT_B)
NetR159_2: R159.2 U110.7(OUT_A)
NetR160_2: R160.2 U110.5(OUT_B)
NetR165_2: R165.2 U111.7(OUT_A)
NetR166_2: R166.2 U111.5(OUT_B)
NetR171_2: R171.2 U112.7(OUT_A)
NetR172_2: R172.2 U112.5(OUT_B)
NetR179_1: R179.1 Z107.K ; port com7
NetR180_1: R180.1 Z108.K ; port com8
NetR181_1: R181.1 Z109.K ; port com9
NetR182_1: R182.1 Z110.K ; port com10
NetR183_1: R183.1 Z111.K ; port com11
NetR184_1: R184.1 Z112.K ; port com12

Not connected (* = marked no-connect by the designer): U107 1(NC)* 8(NC)*; U108 1(NC)* 8(NC)*; U109 1(NC)* 8(NC)*; U110 1(NC)* 8(NC)*; U111 1(NC)* 8(NC)*; U112 1(NC)* 8(NC)*

### Notes on the sheet
- (in symbol Dicap) each

### Library data of the parts
C141 C142 C147 C148 C153 C154 C159 C160 C165 C166 C171 C172 = Capacitor Ceramic: Ceramic Chip Capacitor
R137-R172 R179-R184 = Resistor

## Nets that join several sheets
10v0: power (C313.2 D302.K R303.2 Z302.K), epm_control_1 (18 pins), epm_control_2 (18 pins)
26v0: power (C311.2 D301.K R301.2 Z301.K), epm_control_1 (36 pins), epm_control_2 (36 pins)
GND: power (16 pins), comm_sensing (11 pins), uC (17 pins), epm_control_1 (66 pins), epm_control_2 (66 pins)
Vbat: power (7 pins), comm_sensing (9 pins), uC (11 pins)
M1+: uC (U1.27), epm_control_1 (Q1,4.1 U101.4)
M1-: uC (U1.28), epm_control_1 (Q1,4.3 U101.2)
M2+: uC (U1.30), epm_control_1 (Q7,10.1 U102.4)
M2-: uC (U1.31), epm_control_1 (Q7,10.3 U102.2)
M3+: uC (U1.32), epm_control_1 (Q13,16.1 U103.4)
M3-: uC (U1.1), epm_control_1 (Q13,16.3 U103.2)
M4+: uC (U1.2), epm_control_1 (Q19,22.1 U104.4)
M4-: uC (U1.3), epm_control_1 (Q19,22.3 U104.2)
M5+: uC (U1.6), epm_control_1 (Q25,28.1 U105.4)
M5-: uC (U1.9), epm_control_1 (Q25,28.3 U105.2)
M6+: uC (U1.10), epm_control_1 (Q31,34.1 U106.4)
M6-: uC (U1.11), epm_control_1 (Q31,34.3 U106.2)
M7+: uC (U1.12), epm_control_2 (Q37,40.1 U107.4)
M7-: uC (U1.13), epm_control_2 (Q37,40.3 U107.2)
M8+: uC (U2.25), epm_control_2 (Q43,46.1 U108.4)
M8-: uC (U2.26), epm_control_2 (Q43,46.3 U108.2)
M9+: uC (U2.30), epm_control_2 (Q49,52.1 U109.4)
M9-: uC (U2.31), epm_control_2 (Q49,52.3 U109.2)
M10+: uC (U2.1), epm_control_2 (Q55,58.1 U110.4)
M10-: uC (U2.2), epm_control_2 (Q55,58.3 U110.2)
M11+: uC (U2.9), epm_control_2 (Q61,64.1 U111.4)
M11-: uC (U2.10), epm_control_2 (Q61,64.3 U111.2)
M12+: uC (U2.11), epm_control_2 (Q67,70.1 U112.4)
M12-: uC (U2.12), epm_control_2 (Q67,70.3 U112.2)
NetR173_1: comm_sensing (U6.1), epm_control_1 (R173.1 Z101.K)
NetR174_1: comm_sensing (U6.2), epm_control_1 (R174.1 Z102.K)
NetR175_1: comm_sensing (U6.3), epm_control_1 (R175.1 Z103.K)
NetR176_1: comm_sensing (U6.4), epm_control_1 (R176.1 Z104.K)
NetR177_1: comm_sensing (U6.15), epm_control_1 (R177.1 Z105.K)
NetR178_1: comm_sensing (U6.14), epm_control_1 (R178.1 Z106.K)
NetR179_1: comm_sensing (U7.1), epm_control_2 (R179.1 Z107.K)
NetR180_1: comm_sensing (U7.2), epm_control_2 (R180.1 Z108.K)
NetR181_1: comm_sensing (U7.3), epm_control_2 (R181.1 Z109.K)
NetR182_1: comm_sensing (U7.4), epm_control_2 (R182.1 Z110.K)
NetR183_1: comm_sensing (U7.14), epm_control_2 (R183.1 Z111.K)
NetR184_1: comm_sensing (U7.15), epm_control_2 (R184.1 Z112.K)
NetU1_25: power (U3.4), uC (U1.25)
NetU1_26: power (U4.4), uC (U1.26)
NetU2_19: comm_sensing (U9.7), uC (U2.19)
NetU2_22: comm_sensing (U9.1), uC (U2.22)
NetU2_23: comm_sensing (U5.12), uC (U2.23)
NetU2_24: comm_sensing (U5.11), uC (U2.24)